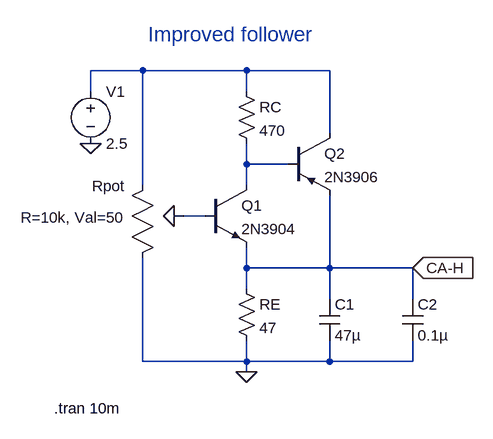
[diagram p0: schematic improved_follower_1v5_ltspice.asc]
improved_follower_1v5_ltspice.asc, the LTspice schematic file:
Version 4
SHEET 1 880 680
WIRE 64 112 -16 112
WIRE 224 112 64 112
WIRE 352 112 224 112
WIRE -16 144 -16 112
WIRE 224 144 224 112
WIRE 352 208 352 112
WIRE 224 256 224 224
WIRE 288 256 224 256
WIRE 64 288 64 112
WIRE 224 288 224 256
WIRE 160 336 128 336
WIRE 224 416 224 384
WIRE 352 416 352 304
WIRE 352 416 224 416
WIRE 480 416 352 416
WIRE 224 448 224 416
WIRE 352 464 352 416
WIRE 480 464 480 416
WIRE 64 560 64 400
WIRE 224 560 224 528
WIRE 224 560 64 560
WIRE 352 560 352 528
WIRE 352 560 224 560
WIRE 480 560 480 528
WIRE 480 560 352 560
WIRE 224 576 224 560
FLAG -16 224 0
FLAG 224 576 0
FLAG 480 416 CA-H
IOPIN 480 416 In
SYMBOL npn 160 288 R0
SYMATTR InstName Q1
SYMATTR Value 2N3904
SYMBOL pnp 288 208 R0
SYMATTR InstName Q2
SYMATTR Value 2N3906
SYMBOL potentiometer 80 304 M0
WINDOW 0 43 -14 Left 2
WINDOW 39 44 34 Left 2
SYMATTR InstName Rpot
SYMATTR SpiceLine R=10k, Val=50
SYMBOL res 208 128 R0
SYMATTR InstName RC
SYMATTR Value 470
SYMBOL res 208 432 R0
SYMATTR InstName RE
SYMATTR Value 47
SYMBOL cap 336 464 R0
SYMATTR InstName C1
SYMATTR Value 47µ
SYMBOL cap 464 464 R0
SYMATTR InstName C2
SYMATTR Value 0.1µ
SYMBOL voltage -16 128 R0
WINDOW 123 0 0 Left 0
WINDOW 39 0 0 Left 0
SYMATTR InstName V1
SYMATTR Value 2.5
TEXT 72 56 Left 3 ;Improved follower
TEXT -72 632 Left 2 !.tran 10m

The netlist it stands for:
* improved_follower_1v5_ltspice.asc
Q1 N002 N003 CA-H 0 2N3904
Q2 N001 N002 CA-H 0 2N3906
XRpot N001 N003 0 potentiometer R=10k, Val=50  ; pins 1 2 3
RC N001 N002 470
RE CA-H 0 47
C1 CA-H 0 47µ
C2 CA-H 0 0.1µ
V1 N001 0 2.5
.model NPN NPN
.model PNP PNP
.lib standard.bjt
* Improved follower
.tran 10m
.backanno
.end